# Altium schematic sheet LoadSwitches.SchDoc: Load Switches
size A; SheetNumber: 10; SheetTotal: 13
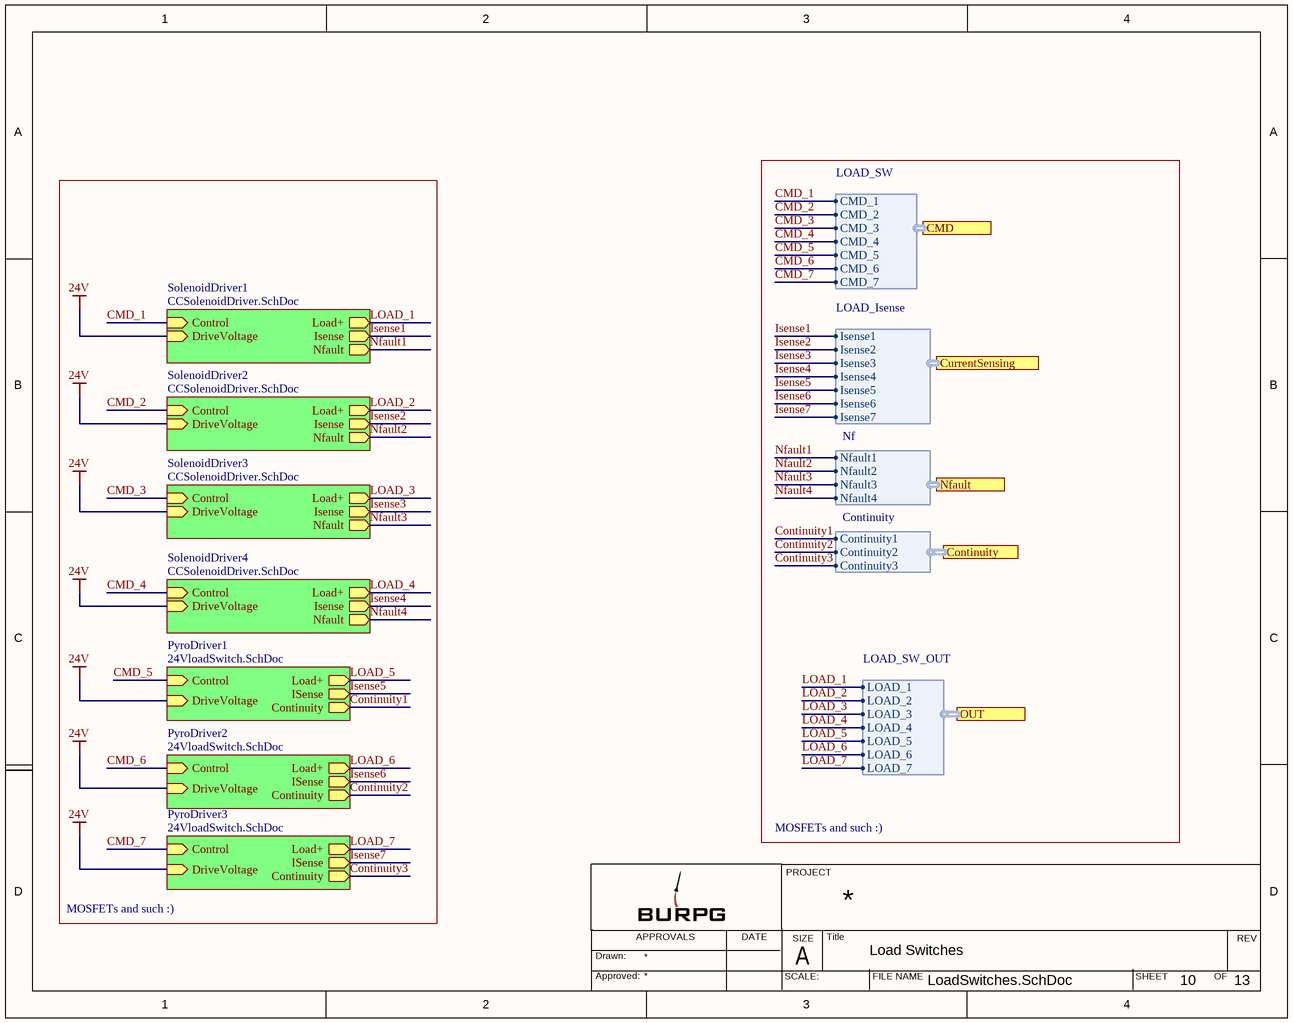
[diagram p0: LoadSwitches.SchDoc]

## Sub-sheets
PyroDriver1 = 24VloadSwitch.SchDoc: Load+ (out), Control (in), ISense (out), DriveVoltage (in), Continuity (out)
PyroDriver2 = 24VloadSwitch.SchDoc: Load+ (out), Control (in), ISense (out), DriveVoltage (in), Continuity (out)
PyroDriver3 = 24VloadSwitch.SchDoc: Load+ (out), Control (in), ISense (out), DriveVoltage (in), Continuity (out)
SolenoidDriver1 = CCSolenoidDriver.SchDoc: Load+ (out), Control (in), Isense (out), Nfault (out), DriveVoltage (in)
SolenoidDriver2 = CCSolenoidDriver.SchDoc: Load+ (out), Isense (out), Control (in), Nfault (out), DriveVoltage (in)
SolenoidDriver3 = CCSolenoidDriver.SchDoc: Load+ (out), Control (in), DriveVoltage (in), Isense (out), Nfault (out)
SolenoidDriver4 = CCSolenoidDriver.SchDoc: Load+ (out), Control (in), DriveVoltage (in), Isense (out), Nfault (out)

## Ports
CMD (harness LOAD_SW), Continuity (harness Continuity), CurrentSensing (harness LOAD_Isense), Nfault (harness Nf), OUT (harness LOAD_SW_OUT)

## Harnesses
LOAD_SW: CMD_1, CMD_2, CMD_3, CMD_4, CMD_5, CMD_6, CMD_7
LOAD_SW_OUT: LOAD_1, LOAD_2, LOAD_3, LOAD_4, LOAD_5, LOAD_6, LOAD_7
LOAD_Isense: Isense1, Isense2, Isense3, Isense4, Isense5, Isense6, Isense7
Nf: Nfault1, Nfault2, Nfault3, Nfault4
Continuity: Continuity1, Continuity2, Continuity3

## Nets
24V: sheet SolenoidDriver1/DriveVoltage, sheet SolenoidDriver2/DriveVoltage, sheet SolenoidDriver3/DriveVoltage, sheet SolenoidDriver4/DriveVoltage, sheet PyroDriver1/DriveVoltage, sheet PyroDriver2/DriveVoltage, sheet PyroDriver3/DriveVoltage
CMD_1: sheet SolenoidDriver1/Control, port CMD.CMD_1
CMD_2: sheet SolenoidDriver2/Control, port CMD.CMD_2
CMD_3: sheet SolenoidDriver3/Control, port CMD.CMD_3
CMD_4: sheet SolenoidDriver4/Control, port CMD.CMD_4
CMD_5: sheet PyroDriver1/Control, port CMD.CMD_5
CMD_6: sheet PyroDriver2/Control, port CMD.CMD_6
CMD_7: sheet PyroDriver3/Control, port CMD.CMD_7
Continuity1: sheet PyroDriver1/Continuity, port Continuity.Continuity1
Continuity2: sheet PyroDriver2/Continuity, port Continuity.Continuity2
Continuity3: sheet PyroDriver3/Continuity, port Continuity.Continuity3
Isense1: sheet SolenoidDriver1/Isense, port CurrentSensing.Isense1
Isense2: sheet SolenoidDriver2/Isense, port CurrentSensing.Isense2
Isense3: sheet SolenoidDriver3/Isense, port CurrentSensing.Isense3
Isense4: sheet SolenoidDriver4/Isense, port CurrentSensing.Isense4
Isense5: sheet PyroDriver1/ISense, port CurrentSensing.Isense5
Isense6: sheet PyroDriver2/ISense, port CurrentSensing.Isense6
Isense7: sheet PyroDriver3/ISense, port CurrentSensing.Isense7
LOAD_1: sheet SolenoidDriver1/Load+, port OUT.LOAD_1
LOAD_2: sheet SolenoidDriver2/Load+, port OUT.LOAD_2
LOAD_3: sheet SolenoidDriver3/Load+, port OUT.LOAD_3
LOAD_4: sheet SolenoidDriver4/Load+, port OUT.LOAD_4
LOAD_5: sheet PyroDriver1/Load+, port OUT.LOAD_5
LOAD_6: sheet PyroDriver2/Load+, port OUT.LOAD_6
LOAD_7: sheet PyroDriver3/Load+, port OUT.LOAD_7
Nfault1: sheet SolenoidDriver1/Nfault, port Nfault.Nfault1
Nfault2: sheet SolenoidDriver2/Nfault, port Nfault.Nfault2
Nfault3: sheet SolenoidDriver3/Nfault, port Nfault.Nfault3
Nfault4: sheet SolenoidDriver4/Nfault, port Nfault.Nfault4

## Notes on the sheet
- MOSFETs and such :)
- PROJECT
- Drawn:
- Approved:
- APPROVALS
- DATE
- SCALE:
- SIZE
- A
- Title
- FILE NAME
- SHEET
- OF
- REV